# EAGLE design master_jorge3 (EAGLE 7.1.0)
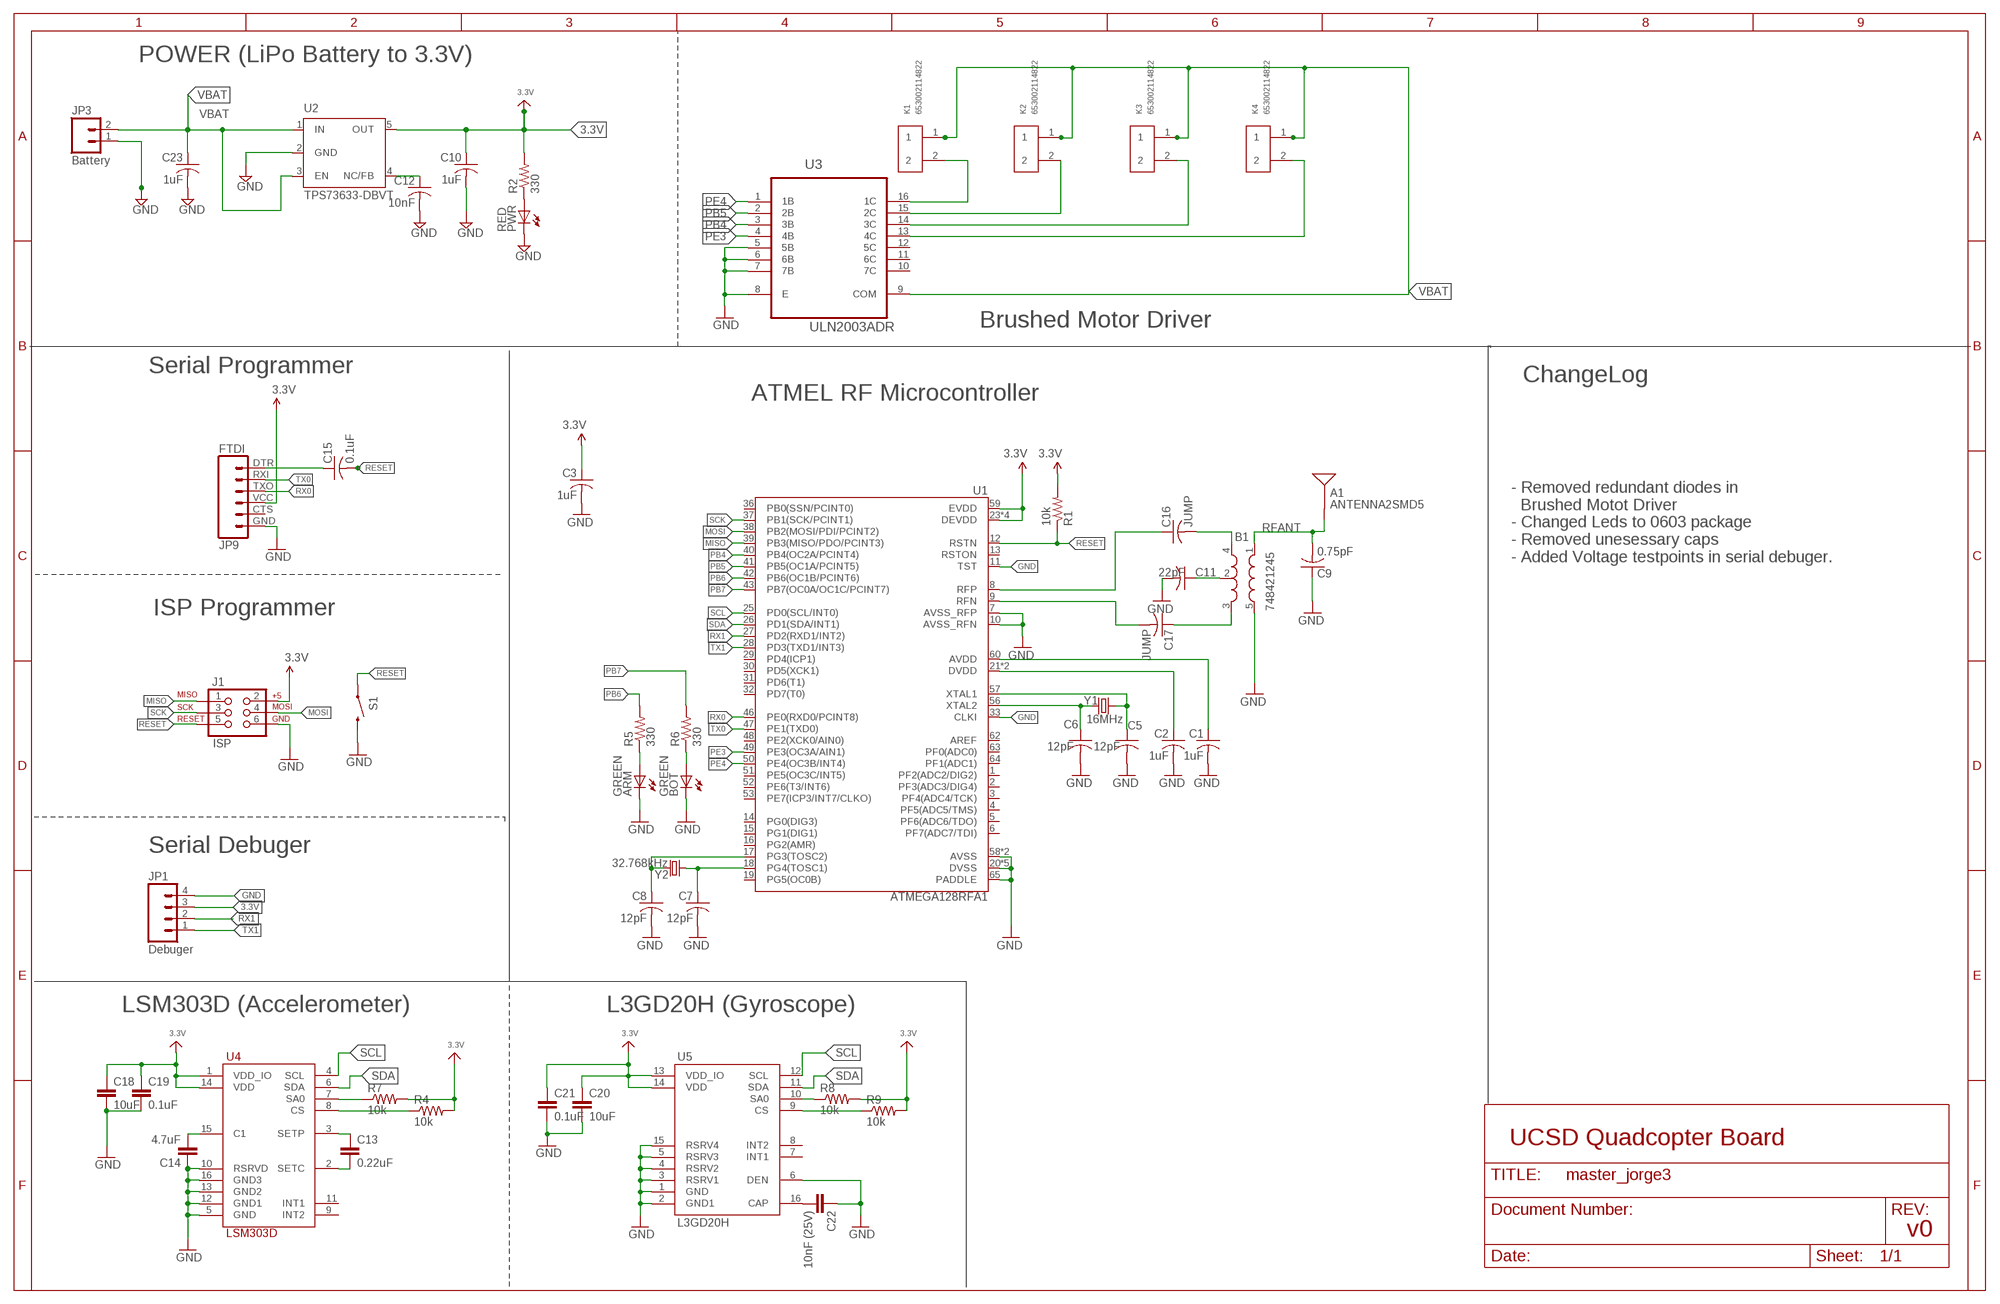
[diagram p0: schematic, sheet 1]

## Parts
A1  ANTENNA2SMD5  [ANTENNA-CHIP5]
ARM  GREEN  LEDCHIPLED_0603  [CHIPLED_0603]
B1  748421245  BALUN0805  [BALUN]
BOT  GREEN  LEDCHIPLED_0603  [CHIPLED_0603]
C1  1uF  C-USC0805  [C0805]
C2  1uF  C-USC0805  [C0805]
C3  1uF  C-USC0805  [C0805]
C5  12pF  C-USC0805  [C0805]
C6  12pF  C-USC0805  [C0805]
C7  12pF  C-USC0805  [C0805]
C8  12pF  C-USC0805  [C0805]
C9  0.75pF  C-USC0805  [C0805]
C10  1uF  C-USC0805  [C0805]
C11  22pF  C-USC0805  [C0805]
C12  10nF  C-USC0805  [C0805]
C13  0.22uF  CAP0805  [0805]
C14  4.7uF  CAP0805  [0805]
C15  0.1uF  C-USC0805  [C0805]
C16  JUMP  C-USC0805  [C0805]
C17  JUMP  C-USC0805  [C0805]
C18  10uF  CAP0805  [0805]
C19  0.1uF  CAP0805  [0805]
C20  10uF  CAP0805  [0805]
C21  0.1uF  CAP0805  [0805]
C22  10nF (25V)  CAP0805  [0805]
C23  1uF  C-USC0805  [C0805]
J1  ISP  AVR_SPI_PRG_6NS  [2X3-NS]
JP1  Debuger  M04PTH  [1X04]
JP3  Battery  M02PTH  [1X02]
JP9  FTDI  FTDI_BASICPTH  [FTDI_BASIC]
K1  653002114822  [653002114822]
K2  653002114822  [653002114822]
K3  653002114822  [653002114822]
K4  653002114822  [653002114822]
PWR  RED  LEDCHIPLED_0603  [CHIPLED_0603]
R1  10k  R-US_R0805  [R0805]
R2  330  R-US_R0805  [R0805]
R4  10k  RESISTOR0805-RES  [0805]
R5  330  R-US_R0805  [R0805]
R6  330  R-US_R0805  [R0805]
R7  10k  RESISTOR0805-RES  [0805]
R8  10k  RESISTOR0805-RES  [0805]
R9  10k  RESISTOR0805-RES  [0805]
S1  SWITCH-MOMENTARY-2SMD  [TACTILE_SWITCH_SMD]
U1  ATMEGA128RFA1  [QFN-64]
U2  TPS73633-DBVT  [SOT23-DBV]
U3  ULN2003ADR  [SOIC127P600X175-16N]
U4  LSM303D  [LGA16_3X3MM]
U5  L3GD20H  [LGA16_3X3MM]
Y1  16MHz  CRYSTAL5X3  [CRYSTAL-SMD-5X3]
Y2  32.768kHz  CRYSTAL32-SMD  [CRYSTAL-32KHZ-SMD]

## Nets
3.3V: C3.1 C10.1 C18.1 C19.1 C20.1 C21.1 J1.2 JP1.3 JP9.VCC R1.2 R2.2 R4.2 R7.2 R8.2 R9.2 U1.23(DEVDD) U1.34(DEVDD) U1.44(DEVDD) U1.54(DEVDD) U1.59(EVDD) U2.5(OUT) U4.1(VDD_IO) U4.14(VDD) U5.13(VDD_IO) U5.14(VDD)
AVDD: C1.1 U1.60(AVDD)
DTR: C15.1 JP9.DTR
DVDD: C2.1 U1.21(DVDD) U1.22(DVDD)
GND: ARM.C B1.5(GND) BOT.C C1.2 C2.2 C3.2 C5.2 C6.2 C7.2 C8.2 C9.1 C10.2 C11.2 C12.2 C14.1 C18.2 C19.2 C20.2 C21.2 C22.1 C23.2 J1.6 JP1.4 JP3.1 JP9.GND PWR.C S1.3 U1.7(AVSS_RFP) U1.10(AVSS_RFN) U1.11(TST) U1.20(DVSS) U1.24(DVSS) U1.33(CLKI) U1.35(DVSS) U1.45(DVSS) U1.55(DVSS) U1.58(AVSS) U1.61(AVSS) U1.65(PADDLE) U2.2(GND) U3.5(5B) U3.6(6B) U3.7(7B) U3.8(E) U4.5(GND) U4.10(RSRVD) U4.12(GND1) U4.13(GND2) U4.16(GND3) U5.1(GND) U5.2(GND1) U5.3(RSRV1) U5.4(RSRV2) U5.5(RSRV3) U5.6(DEN) U5.15(RSRV4)
MISO: J1.1 U1.39(PB3(MISO/PDO/PCINT3))
MOSI: J1.4 U1.38(PB2(MOSI/PDI/PCINT2))
N$1: C12.1 U2.4(NC/FB)
N$2: PWR.A R2.1
N$3: C5.1 U1.57(XTAL1) Y1.3
N$4: C6.1 U1.56(XTAL2) Y1.1
N$5: C7.1 U1.18(PG4(TOSC1)) Y2.X1
N$6: C8.1 U1.17(PG3(TOSC2)) Y2.X2
N$7: B1.2(GND) C11.1
N$8: ARM.A R5.1
N$9: C13.1 U4.3(SETP)
N$10: B1.4(OUT1) C16.2
N$11: B1.3(OUT2) C17.1
N$12: C13.2 U4.2(SETC)
N$13: BOT.A R6.1
N$14: R4.1 U4.8(CS)
N$15: R7.1 U4.7(SA0)
N$16: C14.2 U4.15(C1)
N$17: R8.1 U5.10(SA0)
N$18: R9.1 U5.9(CS)
N$19: C22.2 U5.16(CAP)
N$29: K1.2 U3.16(1C)
N$30: K2.2 U3.15(2C)
N$31: K3.2 U3.14(3C)
N$32: K4.2 U3.13(4C)
PB4: U1.40(PB4(OC2A/PCINT4)) U3.3(3B)
PB5: U1.41(PB5(OC1A/PCINT5)) U3.2(2B)
PB6: R5.2 U1.42(PB6(OC1B/PCINT6))
PB7: R6.2 U1.43(PB7(OC0A/OC1C/PCINT7))
PE3: U1.49(PE3(OC3A/AIN1)) U3.4(4B)
PE4: U1.50(PE4(OC3B/INT4)) U3.1(1B)
RESET: C15.2 J1.5 R1.1 S1.1 U1.12(RSTN)
RFANT [RFSIG]: A1.FEED(SIGNAL) B1.1(IN) C9.2
RFN: C17.2 U1.9(RFN)
RFP: C16.1 U1.8(RFP)
RX0: JP9.TXO U1.46(PE0(RXD0/PCINT8))
RX1: JP1.2 U1.27(PD2(RXD1/INT2))
SCK: J1.3 U1.37(PB1(SCK/PCINT1))
SCL: U1.25(PD0(SCL/INT0)) U4.4(SCL) U5.12(SCL)
SDA: U1.26(PD1(SDA/INT1)) U4.6(SDA) U5.11(SDA)
TX0: JP9.RXI U1.47(PE1(TXD0))
TX1: JP1.1 U1.28(PD3(TXD1/INT3))
VBAT: C23.1 JP3.2 K1.1 K2.1 K3.1 K4.1 U2.1(IN) U2.3(EN) U3.9(COM)
Unconnected: JP9.CTS U1.1(PF2(ADC2/DIG2)) U1.2(PF3(ADC3/DIG4)) U1.3(PF4(ADC4/TCK)) U1.4(PF5(ADC5/TMS)) U1.5(PF6(ADC6/TDO)) U1.6(PF7(ADC7/TDI)) U1.13(RSTON) U1.14(PG0(DIG3)) U1.15(PG1(DIG1)) U1.16(PG2(AMR)) U1.19(PG5(OC0B)) U1.29(PD4(ICP1)) U1.30(PD5(XCK1)) U1.31(PD6(T1)) U1.32(PD7(T0)) U1.36(PB0(SSN/PCINT0)) U1.48(PE2(XCK0/AIN0)) U1.51(PE5(OC3C/INT5)) U1.52(PE6(T3/INT6)) U1.53(PE7(ICP3/INT7/CLKO)) U1.62(AREF) U1.63(PF0(ADC0)) U1.64(PF1(ADC1)) U3.10(7C) U3.11(6C) U3.12(5C) U4.9(INT2) U4.11(INT1) U5.7(INT1) U5.8(INT2)

## Notes on the sheet
- POWER (LiPo Battery to 3.3V)
- Brushed Motor Driver
- Serial Programmer
- ChangeLog
- ATMEL RF Microcontroller
- - Removed redundant diodes in 
    Brushed Motot Driver
  - Changed Leds to 0603 package
  - Removed unesessary caps
  - Added Voltage testpoints in serial debuger.
- ISP Programmer
- Serial Debuger
- LSM303D (Accelerometer) | L3GD20H (Gyroscope)
- UCSD Quadcopter Board
- v0

## Library data of the parts
A1 = SparkFun-RF:ANTENNA2: Chip antenna Single endded antenna. Common with smaller chip antennas. CHIP4 package is the GPS Chip Antenna SKU: GPS-08418. CHIP5 package is 2.4GHz chip antenna SKU: WRL-00144.
ARM BOT PWR = led:LED: LED OSRAM: - CHIPLED LG R971, LG N971, LY N971, LG Q971, LY Q971, LO R971, LY R971 LH N974, LH R974 LS Q976, LO Q976, LY Q976 LO Q996 - Hyper CHIPLED LW Q18S LB Q993, LB Q99A, LB R99A - SideLED LS A670, LO A670, LY A670, LG A670, LP A670 LB A673, LV A673, LT A673, LW A673 LH A674 LY A675 LS A676, LA A676, LO A676, LY A676, LW A676 LS A679, LY A679, LG A679 - Hyper Micro SIDELED® LS Y876, LA Y876, LO Y876, LY Y876 LT Y87S - SmartLED LW L88C, LW L88S LB L89C, LB L89S, LG L890 LS L89K, LO L89K, LY L89K LS L896, LA L896, LO L896, LY L896 - TOPLED LS T670, LO T670, LY T670, LG T670, LP T670 LSG T670, LSP T670, LSY T670, LOP T670, LYG T670 LG T671, LOG T671, LSG T671 LB T673, LV T673, LT T673, LW T673 LH T674 LS T676, LA T676, LO T676, LY T676, LB T676, LH T676, LSB T676, LW T676 LB T67C, LV T67C, LT T67C, LS T67K, LO T67K, LY T67K, LW E67C LS E67B, LA E67B, LO E67B, LY E67B, LB E67C, LV E67C, LT E67C LW T67C LS T679, LY T679, LG T679 LS T770, LO T770, LY T770, LG T770, LP T770 LB T773, LV T773, LT T773, LW T773 LH T774 LS E675, LA E675, LY E675, LS T675 LS T776, LA T776, LO T776, LY T776, LB T776 LHGB T686 LT T68C, LB T68C - Hyper Mini TOPLED® LB M676 - Mini TOPLED Santana® LG M470 LS M47K, LO M47K, LY M47K Source: http://www.osram.convergy.de LUXEON: - LUMILED® LXK2-PW12-R00, LXK2-PW12-S00, LXK2-PW14-U00, LXK2-PW14-V00 LXK2-PM12-R00, LXK2-PM12-S00, LXK2-PM14-U00 LXK2-PE12-Q00, LXK2-PE12-R00, LXK2-PE12-S00, LXK2-PE14-T00, LXK2-PE14-U00 LXK2-PB12-K00, LXK2-PB12-L00, LXK2-PB12-M00, LXK2-PB14-N00, LXK2-PB14-P00, LXK2-PB14-Q00 LXK2-PR12-L00, LXK2-PR12-M00, LXK2-PR14-Q00, LXK2-PR14-R00 LXK2-PD12-Q00, LXK2-PD12-R00, LXK2-PD12-S00 LXK2-PH12-R00, LXK2-PH12-S00 LXK2-PL12-P00, LXK2-PL12-Q00, LXK2-PL12-R00 Source: www.luxeon.com KINGBRIGHT: KA-3528ASYC Source: www.kingbright.com
B1 = SparkFun-RF:BALUN: 0805 footprint balun- Ember 351/357
C1-C3 C5-C12 C15-C17 C23 = resistor:C-US: CAPACITOR, American symbol
C13 C14 C18-C22 = SparkFun-Capacitors:CAP: Capacitor Standard 0603 ceramic capacitor, and 0.1" leaded capacitor.
J1 = SparkFun-Connectors:AVR_SPI_PRG_6: AVR ISP 6 Pin This is the reduced ISP connector for AVR programming. Common on Arduino. This footprint will take up less PCB space and can be used with a 10-pin to 6-pin adapter such as SKU: BOB-08508
JP1 = SparkFun-Connectors:M04: Header 4 Standard 4-pin 0.1" header. Use with straight break away headers (SKU : PRT-00116), right angle break away headers (PRT-00553), swiss pins (PRT-00743), machine pins (PRT-00117), and female headers (PRT-00115). Molex polarized connector foot print use with SKU : PRT-08231 with associated crimp pins and housings. 1MM SMD Version SKU: PRT-10208
JP3 = SparkFun:M02: Header 2 Standard 2-pin 0.1" header. Use with straight break away headers (SKU : PRT-00116), right angle break away headers (PRT-00553), swiss pins (PRT-00743), machine pins (PRT-00117), and female headers (PRT-00115). Molex polarized connector foot print use with SKU : PRT-08233 with associated crimp pins and housings.
JP9 = SparkFun-Connectors:FTDI_BASIC: FTDI Basic header with labels
K1-K4 = Wuerth_Elektronik_eiCan_Wire_to_Board_Connectors:653002114822: WR-WTB 1.25mm Male Vertical Shrouded Header, 2 Pins=>Code : Con_WTB_1.25_PCB_THT_653002114822 <http://katalog.we-online.de/media/thumbs2/eican/thb_Con_WTB_1.25_PCB_THT_6530xx114822_pf2.jpg> Details see: http://katalog.we-online.de/en/em/653_0xx_114_822 Created 2014-06-06, Karrer Zheng 2014 (C) Würth Elektronik; OC_FARNELL: unknown
R1 R2 R5 R6 = resistor:R-US_: RESISTOR, American symbol
R4 R7-R9 = SparkFun-Passives:RESISTOR: Resistor Basic schematic elements and footprints for 0603, 1206, and PTH resistors.
S1 = SparkFun-Electromechanical:SWITCH-MOMENTARY-2: Various NO switches- pushbuttons, reed, etc
U1 = SparkFun-DigitalIC:ATMEGA128RFA1: ATmega128RFA1 8-bit AVR Microcontroller with Low Power 2.4GHz Transceiver for ZigBee and IEEE 802.15.4
U2 = Power:TPS73633-DBVT
U3 = Texas Instruments_By_element14_Batch_1:ULN2003ADR: 8-BIT SHIFT REGISTERS WITH 3-STATE OUTPUT REGISTERS; MPN: ULN2003ADR; OC_FARNELL: 1470513; OC_NEWARK: 77C3560; PACKAGE: SOIC-16; SUPPLIER: TEXAS INSTRUMENTS
U4 = IMU_parts:LSM303D
U5 = IMU_parts:L3GD20H
Y1 Y2 = SparkFun-FreqCtrl:CRYSTAL: Various standard crystals. Proven footprints. Spark Fun Electronics SKU : COM-00534

## Net classes
1 RFSIG: width 0.457 mm, clearance 0.205 mm to class 0, clearance 0.205 mm

## Board
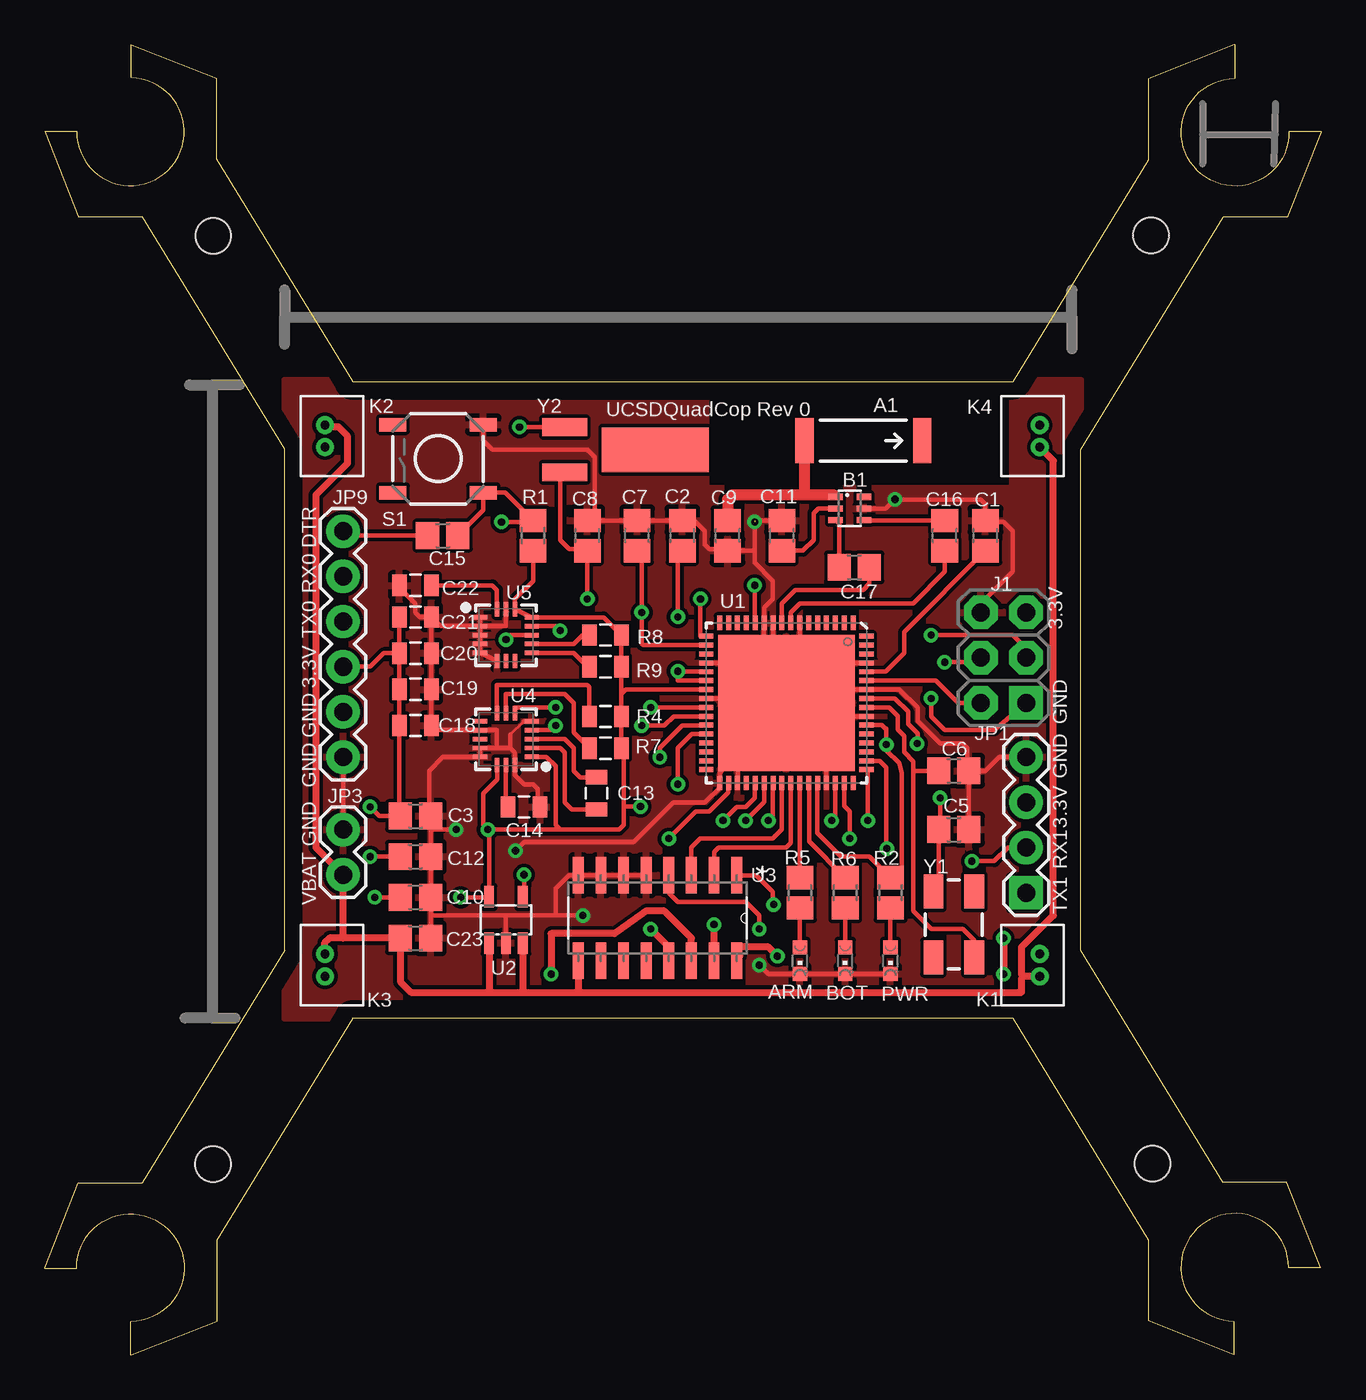
[diagram p1: board, top side]
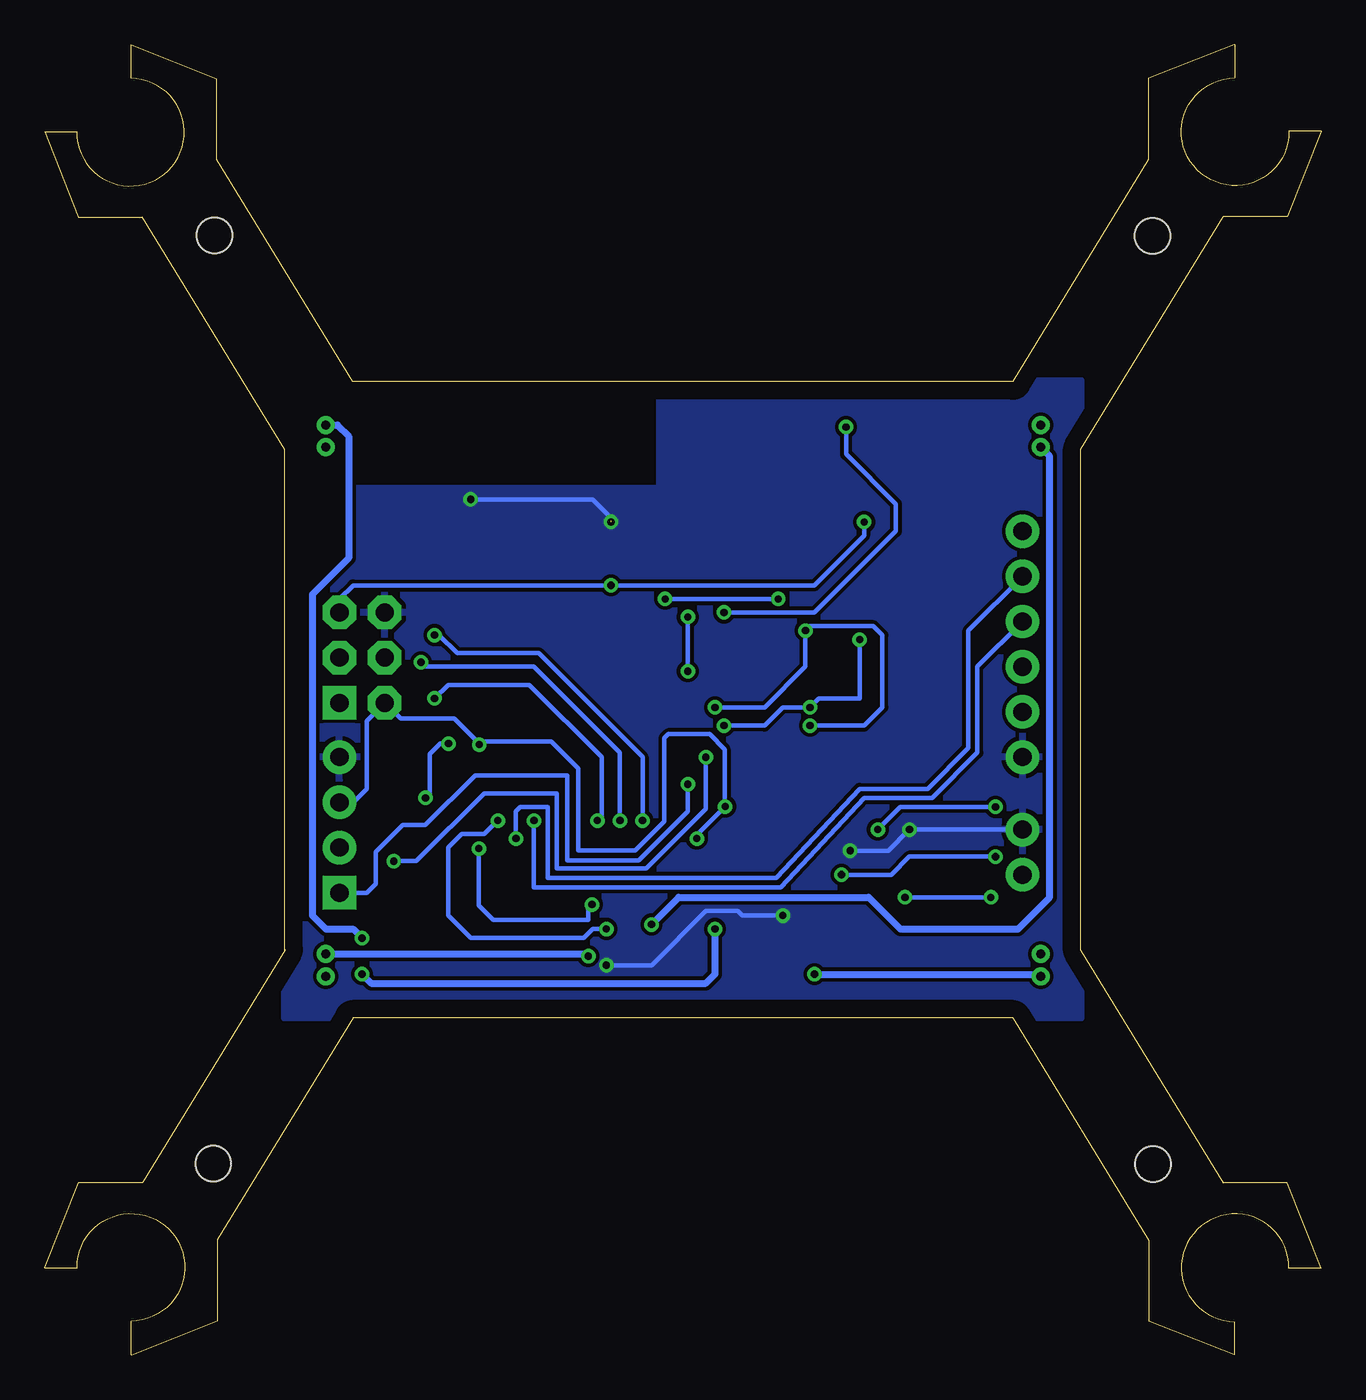
[diagram p2: board, bottom side, seen from below]

Size 71.68 x 73.61 mm. Coordinates in mm from the lower left corner, seen from the top.
Outline: 54.38,18.92 17.3,18.92 17.3,18.9 9.68,6.45 9.68,1.9 4.88,0 4.85,0 4.85,1.88 arc270 1.8,4.9 1.8,4.88 0,4.88 1.91,9.68 5.49,9.68 13.49,22.73 13.49,50.88 5.49,63.93 1.91,63.93 0,68.73 1.8,68.73 1.8,68.71 arc270 4.85,71.73 4.85,73.61 4.88,73.61 9.68,71.7 9.68,67.16 17.3,54.71 17.3,54.66
Outline: 58.19,22.73 58.19,50.85 66.19,63.91 69.77,63.91 71.68,68.71 69.88,68.71 69.88,68.68 arc-270 66.83,71.7 66.83,73.58 66.8,73.58 62,71.68 62,67.13 54.38,54.69
Outline: 17.3,54.68 54.38,54.68
Outline: 54.36,18.92 61.98,6.48 61.98,1.93 66.78,0.02 66.8,0.02 66.8,1.9 arc-270 69.85,4.93 69.85,4.9 71.65,4.9 69.75,9.7 66.17,9.7 58.17,22.76
Copper layers (1*16): Top 0.035mm / dielectric 1.5mm / Bottom 0.035mm
Design rules "default *": minimum track width 1mil, minimum drill 0.003mm, track to track 8mil, track to pad 8mil, pad to pad 8mil, via to via 8mil, smd to smd 8mil, copper to edge 40mil, drill to drill 8mil, minimum pad ring 10mil, minimum via ring 8mil, stop-mask expansion 4mil, vias tented up to drill 0mil, thermal gap 10mil
Holes 2.2 mm at -42.93,48.46
Holes 2 mm at 9.45,10.72 62.2,10.74 9.47,62.86 62.13,62.89
tRestrict: area 41.7,52.9 to 48.4,52.9; area 37.4,48.9 to 41.9,54.5; area 43.5,48.9 to 48.5,54.5; area 49.8,48.9 to 54.1,54.5; area 41.9,53 to 43.5,54.5; area 48.5,53 to 49.8,54.5; area 48.5,48.9 to 49.8,49.9
bRestrict: area 41.9,48.9 to 43.5,53; area 37.4,48.9 to 41.9,54.5; area 41.9,53 to 43.5,54.5; area 43.5,48.9 to 48.5,54.5; area 48.5,53 to 49.8,54.5; area 49.8,48.9 to 54.1,54.5; area 48.5,48.9 to 49.8,49.9

### Footprints (pad centres in the part's own frame; a part is rotated, then mirrored left to right if it is on the bottom)
ANTENNA-CHIP5 = smd 1.016 x 2.54: FEED -3.302,0; NC 3.302,0
CHIPLED_0603 = smd 0.8 x 0.8: A 0,-0.75; C 0,0.75
BALUN = smd 0.35 x 0.8: 1 -0.65,-0.8; 2 0,-0.8; 3 0.65,-0.8; 4 0.65,0.8; 5 0,0.8; 6 -0.65,0.8
C0805 = smd 1.3 x 1.5: 1 -0.85,0; 2 0.85,0
0805 = smd 0.8 x 1.2: 1 -0.9,0; 2 0.9,0
2X3-NS = drill 1.016 pad 1.88 square: 1 -2.54,-1.27 | drill 1.016 pad 1.88 octagon: 2 -2.54,1.27; 3 0,-1.27; 4 0,1.27; 5 2.54,-1.27; 6 2.54,1.27
1X04 = drill 1.016 pad 1.88 square: 1 0,0 | drill 1.016 pad 1.88: 2 2.54,0; 3 5.08,0; 4 7.62,0
1X02 = drill 1.016 pad 1.88: 1 0,0; 2 2.54,0
FTDI_BASIC = drill 1.016 pad 1.88: CTS 10.16,0; DTR 0,0; GND 12.7,0; RXI 2.54,0; TXO 5.08,0; VCC 7.62,0
653002114822 = drill 0.5: 1 0.625,0; 2 -0.625,0
R0805 = smd 1.3 x 1.5: 1 -0.85,0; 2 0.85,0
TACTILE_SWITCH_SMD = smd 1.524 x 0.762: 1 -2.54,1.905; 2 2.54,1.905; 3 -2.54,-1.905; 4 2.54,-1.905
QFN-64 = smd 0.8 x 0.28: 1 -4.5,3.75; 2 -4.5,3.25; 3 -4.5,2.75; 4 -4.5,2.25; 5 -4.5,1.75; 6 -4.5,1.25; 7 -4.5,0.75; 8 -4.5,0.25; 9 -4.5,-0.25; 10 -4.5,-0.75; 11 -4.5,-1.25; 12 -4.5,-1.75; 13 -4.5,-2.25; 14 -4.5,-2.75; 15 -4.5,-3.25; 16 -4.5,-3.75; 33 4.5,-3.75; 34 4.5,-3.25; 35 4.5,-2.75; 36 4.5,-2.25; 37 4.5,-1.75; 38 4.5,-1.25; 39 4.5,-0.75; 40 4.5,-0.25; 41 4.5,0.25; 42 4.5,0.75; 43 4.5,1.25; 44 4.5,1.75; 45 4.5,2.25; 46 4.5,2.75; 47 4.5,3.25; 48 4.5,3.75 | smd 0.28 x 0.8: 17 -3.75,-4.5; 18 -3.25,-4.5; 19 -2.75,-4.5; 20 -2.25,-4.5; 21 -1.75,-4.5; 22 -1.25,-4.5; 23 -0.75,-4.5; 24 -0.25,-4.5; 25 0.25,-4.5; 26 0.75,-4.5; 27 1.25,-4.5; 28 1.75,-4.5; 29 2.25,-4.5; 30 2.75,-4.5; 31 3.25,-4.5; 32 3.75,-4.5; 49 3.75,4.5; 50 3.25,4.5; 51 2.75,4.5; 52 2.25,4.5; 53 1.75,4.5; 54 1.25,4.5; 55 0.75,4.5; 56 0.25,4.5; 57 -0.25,4.5; 58 -0.75,4.5; 59 -1.25,4.5; 60 -1.75,4.5; 61 -2.25,4.5; 62 -2.75,4.5; 63 -3.25,4.5; 64 -3.75,4.5 | smd 7.65 x 7.65: 65 0,0
SOT23-DBV = smd 0.55 x 1.2: 1 -0.95,-1.3; 2 0,-1.3; 3 0.95,-1.3; 4 0.95,1.3; 5 -0.95,1.3
SOIC127P600X175-16N = smd 2.057 x 0.61: 1 -4.801,8.89; 2 -4.801,7.62; 3 -4.801,6.35; 4 -4.801,5.08; 5 -4.801,3.81; 6 -4.801,2.54; 7 -4.801,1.27; 8 -4.801,0; 9 0,0; 10 0,1.27; 11 0,2.54; 12 0,3.81; 13 0,5.08; 14 0,6.35; 15 0,7.62; 16 0,8.89
LGA16_3X3MM = smd 0.8 x 0.25: 1 -1.45,1; 2 -1.45,0.5; 3 -1.45,0; 4 -1.45,-0.5; 5 -1.45,-1; 9 1.45,-1; 10 1.45,-0.5; 11 1.45,0; 12 1.45,0.5; 13 1.45,1 | smd 0.25 x 0.8: 6 -0.5,-1.45; 7 0,-1.45; 8 0.5,-1.45; 14 0.5,1.45; 15 0,1.45; 16 -0.5,1.45
CRYSTAL-SMD-5X3 = smd 1.9 x 1.1: 1 -1.85,-1.15; 2 1.85,-1.15; 3 1.85,1.15; 4 -1.85,1.15
CRYSTAL-32KHZ-SMD = smd 2.5 x 6: SHEILD 0,5.08 | smd 1 x 2.5: X1 -1.27,0; X2 1.27,0

### Placement (x,y rotation side)
A1  45.97,51.36 0 top
ARM  42.42,22.15 180 top
B1  45.21,47.55 270 top
BOT  44.96,22.15 180 top
C1  52.83,46.02 90 top
C2  35.81,46.02 90 top
C3  20.83,30.28 0 top
C5  51.05,29.51 0 top
C6  51.05,32.82 0 top
C7  33.27,46.02 90 top
C8  30.48,46.02 90 top
C9  38.35,46.02 90 top
C10  20.83,25.7 0 top
C11  41.4,46.02 90 top
C12  20.83,27.99 0 top
C13  30.99,31.55 270 top
C14  26.92,30.78 180 top
C15  22.35,46.02 0 top
C16  50.55,46.02 90 top
C17  45.47,44.25 0 top
C18  20.83,35.36 0 top
C19  20.83,37.39 0 top
C20  20.83,39.42 0 top
C21  20.83,41.45 0 top
C22  20.83,43.23 0 top
C23  20.83,23.42 0 top
J1  53.85,39.17 90 top
JP1  55.12,25.96 90 top
JP3  16.76,29.51 270 top
JP9  16.76,46.28 270 top
K1  55.88,21.89 270 top
K2  15.75,51.61 90 top
K3  15.75,21.89 90 top
K4  55.88,51.61 270 top
PWR  47.5,22.15 180 top
R1  27.43,46.02 270 top
R2  47.5,25.96 90 top
R4  31.5,35.86 0 top
R5  42.42,25.96 90 top
R6  44.96,25.96 90 top
R7  31.5,34.09 0 top
R8  31.5,40.44 0 top
R9  31.5,38.66 0 top
S1  22.1,50.34 180 top
U1  41.66,36.63 270 top
U2  25.91,24.43 0 top
U3  29.97,22.15 270 top
U4  25.91,34.59 180 top
U5  25.91,40.44 0 top
Y1  51.05,24.18 90 top
Y2  29.21,50.85 270 top

### Tracks (layer width: path | path; a pad name or v marks a point on that pad's centre or on a via)
3.3V  (via drill 0.41)
  Top 0.254: 32.4,37.13 R9.2 R8.2 31.4,41.44 U5.13 U5.14 26.41,42.46 27.43,43.48 R1.2 | 32.4,37.13 R4.2 R7.2 32.51,33.97 32.51,30.82 | J1.2 51.31,36.63 50.04,37.9 46.18,37.9 U1.59 | 32.51,30.82 32.51,29.77 32.26,29.52 28.96,29.52 | U1.23 32.64,37.38 32.4,37.13 | C21.1 C20.1 | C20.1 C19.1 C18.1 19.93,30.33 C3.1 18.8,30.28 v18.29,30.78 | U4.14 25.41,32.32 24.64,31.55 24.64,29.77 v24.89,29.52 | v24.89,29.52 28.96,29.52 | U4.1 28.18,33.59 28.7,33.07 28.7,29.77 28.96,29.52 | C20.1 19.05,39.42 18.29,38.66 JP9.VCC | v24.89,29.52 24.96,29.45 U2.5 24.93,25.7 v23.37,25.7 | C10.1 v18.54,25.7 | U1.54 47.02,35.38 47.22,35.18 47.27,35.18 v47.27,34.29 47.27,33.96 47.98,33.25 48.13,32.69 48.13,27.32 R2.2 46.32,27.99 44.7,27.99 43.38,29.31 43.38,32.11 | U1.34 38.4,31.6 37.34,30.53 36.58,30.53 v35.05,29.01 | 43.38,32.13 U1.44 43.38,32.11 | 43.38,32.23 43.38,32.11 | v33.46,30.81 32.53,30.81 32.51,30.82
  Bottom 0.254: v18.29,30.78 23.62,30.78 v24.89,29.52 | v18.54,25.7 v23.37,25.7 | JP1.3 54.36,31.04 53.59,31.8 53.59,35.61 J1.2 51.69,35.74 48.67,35.74 47.27,34.34 v47.27,34.29 47.09,34.47 43.23,34.47 41.71,32.94 41.71,28.35 38.51,28.35 36.88,29.97 36.88,34.65 36.65,34.87 34.34,34.87 33.49,34.02 33.49,30.84 v33.46,30.81 35.05,29.21 v35.05,29.01
AVDD
  Top 0.254: U1.60 46.18,38.41 47.24,38.41 48.26,39.42 48.26,40.6 C1.1
DTR
  Top 0.254: C15.1 17.02,46.02 JP9.DTR
DVDD  (via drill 0.41)
  Top 0.254: C2.1 35.56,45.17 v35.56,41.45 | U1.22 37.16,37.9 35.56,37.9 v35.56,38.41 37.16,38.41 U1.21
  Bottom 0.254: v35.56,41.45 v35.56,38.41
GND  (via drill 0.41)  (1 unrouted)
  Top 0.178: 26.16,34.85 26.92,35.61
  Top 0.241: 26.92,35.61 27.34,35.61 U4.5
  Top 0.254: C23.2 21.68,24.69 | 21.68,24.69 C10.2 C12.2 21.68,29.52 | 21.68,29.52 C3.2 21.59,30.36 21.59,32.82 22.37,33.59 U4.13 U4.12 | 25.91,24.69 21.68,24.69 | C6.2 C5.2 | U3.5 U3.6 U3.7 U3.8 29.44,26.95 28.7,26.21 28.7,24.69 | 31.01,46.88 C7.2 C2.2 36.49,46.88 37.08,46.28 37.08,45.52 37.34,45.26 38.27,45.26 C9.1 39.88,45.17 | 31.01,46.88 C8.2 | 24.64,52.38 S1.3 24.64,51.36 25.15,50.85 30.48,50.85 30.89,50.44 30.89,47 31.01,46.88 | U5.2 24.45,40.94 22.24,40.94 C21.2 | 26.16,34.09 26.41,33.84 U4.16 26.41,32.57 26.92,32.05 27.43,32.05 27.69,31.8 27.69,30.92 C14.1 | 26.16,34.09 25.4,34.09 | 25.4,34.09 U4.12 | U4.12 | U4.5 26.91,35.59 | 26.16,34.85 26.16,34.09 | U5.1 U5.2 | U5.2 U5.3 U5.4 U5.5 U5.6 | 25.4,34.09 25.4,35.1 25.39,35.09 U4.10 21.99,35.09 C18.2 C19.2 C20.2 C21.2 | JP9.GND JP3.1 | U5.15 25.91,40.94 24.46,40.94 U5.2 | C22.1 19.93,43.11 20.83,42.22 20.83,41.71 21.08,41.45 C21.2 | v23.11,29.52 21.68,29.52 | JP1.4 53.59,33.58 52.83,32.82 C6.2 | U1.10 40.91,37.38 | 40.91,37.38 U1.65 | 40.91,37.38 40.41,36.88 39.07,36.88 | U1.7 42.41,38.88 | 42.41,38.88 40.91,37.38 | 42.41,38.88 U1.61 | U1.10 40.91,39.69 40.39,39.17 40.39,41.11 U1.11 40.41,41.98 40.89,42.47 40.89,43.48 39.88,44.5 39.88,45.17 | U1.10 40.91,39.16 41.4,38.66 39.12,38.66 38.86,38.91 38.83,38.88 U1.20 | U1.10 40.91,40.17 43.69,37.39 | 43.69,37.39 46.16,37.39 | U1.10 40.91,36.64 | 39.88,45.17 39.88,46.88 C11.2 | B1.5 47.24,47.55 v47.75,48.06 52.58,48.06 52.83,47.8 C1.2 52.92,46.79 53.85,46.79 54.36,46.28 54.36,43.99 52.58,42.22 J1.6 | 46.17,37.39 U1.58 46.16,37.39 | 47.5,21.39 PWR.C BOT.C ARM.C 40.63,21.4 v40.13,21.89 | v30.23,24.69 28.7,24.69
  Top 0.254: C6.2 51.82,32.91 51.82,34.09 51.56,34.34 50.29,34.34 49.02,35.61 49.02,36.37 48.01,37.39 46.16,37.39 | U2.2 25.91,24.69 | 25.91,24.69 28.7,24.69 | U1.24 39.07,36.88 | 38.91,33.86 37.91,32.7 U1.33 37.91,31.86 37.08,31.04 35.31,31.04 33.78,29.52 33.09,28.82 26.94,28.82 v26.44,28.32 | 38.91,33.86 39.12,34.09 39.12,36.83 39.07,36.88 | U1.45 43.91,35.88 | 43.91,35.88 43.91,37.17 43.69,37.39 | U1.55 43.91,35.88 | U1.35 38.91,33.86
  Bottom 0.254: JP3.1 v23.11,29.52 24.31,28.32 v26.44,28.32 | v39.88,46.79 39.88,47.04 40.89,48.06 v47.75,48.06 | v30.23,24.69 32.51,24.69 32.77,24.94 34.54,24.94 37.59,21.89 v40.13,21.89
  pour Top: 13.49,54.74 13.49,18.92 58.19,18.92 58.19,54.74
  pour Bottom: 13.49,54.74 13.49,18.92 58.19,18.92 58.19,54.74
MISO  (via drill 0.41)
  Top 0.254: v40.64,30.02 40.89,30.28 40.89,32.11 U1.39 | J1.1 53.34,35.1 50.55,35.1 49.78,35.86 v49.78,36.88
  Bottom 0.254: v40.64,30.02 40.39,30.28 40.39,33.58 44.45,37.64 49.02,37.64 v49.78,36.88
MOSI  (via drill 0.41)
  Top 0.254: U1.38 40.41,31.06 v39.37,30.02 | v50.55,38.91 52.32,38.91 J1.4
  Bottom 0.254: v39.37,30.02 39.37,33.83 44.2,38.66 50.29,38.66 v50.55,38.91
N$1  (via drill 0.41)
  Top 0.254: C12.1 v18.29,27.99 | v26.92,26.97 26.92,25.8 U2.4
  Bottom 0.254: v18.29,27.99 23.11,27.99 24.13,26.97 v26.92,26.97
N$2
  Top 0.254: R2.1 PWR.A
N$3  (via drill 0.41)
  Top 0.254: Y1.3 50.2,26.33 C5.1 50.29,29.6 v50.29,31.29 | U1.57 47.75,36.88 48.49,36.14 48.49,35.43 49.02,34.9 49.02,34.37 v49,34.34
  Bottom 0.254: v50.29,31.29 50.04,31.55 50.04,33.76 49.45,34.34 v49,34.34
N$4
  Top 0.254: Y1.1 52.2,23.28 51.56,23.93 49.78,23.93 48.77,24.94 48.77,32.82 | 48.77,32.82 48.77,33.35 48.26,33.86 48.26,34.77 47.9,35.13 47.9,35.89 47.42,36.37 U1.56 | C6.1 48.77,32.82
N$5  (via drill 0.41)
  Top 0.254: Y2.X1 29.46,52.12 | Y2.X1 28.45,52.12 | C7.1 33.53,44.92 v33.53,41.71 33.53,39.93 33.55,39.93 33.6,39.88 U1.18 | v26.67,52.12 Y2.X1
  Bottom 0.254: v33.53,41.71 28.45,41.71 23.88,46.28 23.88,47.8 26.67,50.6 v26.67,52.12
N$6  (via drill 0.41)
  Top 0.254: Y2.X2 28.96,49.58 28.96,45.77 29.46,45.26 30.39,45.26 C8.1 v30.48,42.47 | U1.17 36.83,40.38 v36.83,42.47
  Bottom 0.254: v36.83,42.47 v30.48,42.47
N$7
  Top 0.254: C11.1 42.58,45.17 43.18,45.77 43.18,47.3 43.43,47.55 B1.2
N$8
  Top 0.254: R5.1 ARM.A
N$9
  Top 0.254: C13.1 30.09,32.45 29.72,32.82 29.72,34.09 29.21,34.59 U4.3
N$10
  Top 0.254: C16.2 46.04,46.88 B1.4
N$11
  Top 0.254: C17.1 44.62,46.69 B1.3
N$12
  Top 0.254: C13.2 29.6,30.65 29.21,31.04 29.21,33.83 28.95,34.09 U4.2
N$13
  Top 0.254: R6.1 BOT.A
N$14
  Top 0.254: R4.1 30.6,37.53 30.48,37.64 25.4,37.64 U4.8
N$15
  Top 0.254: U4.7 25.91,37.13 29.21,37.13 29.72,36.63 29.72,34.97 R7.1
N$16
  Top 0.254: C14.2 26.02,31.18 25.91,31.29 U4.15
N$17
  Top 0.254: R8.1 30.23,40.44 29.72,39.93 U5.10
N$18
  Top 0.254: R9.1 30.48,38.66 29.72,39.42 27.37,39.42 U5.9
N$19
  Top 0.254: C22.2 25.15,43.23 25.4,42.98 25.4,41.89 U5.16
N$29  (via drill 0.41)
  Top 0.254: 39.12,22.4 U3.16
  Top 0.406: U3.16 38.86,22.91 40.64,22.91 v41.15,22.4
  Bottom 0.254: 41.01,22.52 v41.15,22.4
  Bottom 0.406: K1.2 41.01,22.52
N$30  (via drill 0.41)
  Top 0.406: U3.15 v37.59,24.18
  Bottom 0.406: v37.59,24.18 36.07,25.7 25.4,25.7 23.62,23.93 17.02,23.93 15.24,25.7 15.24,50.48 K2.2
N$31  (via drill 0.41)
  Top 0.406: U3.14 36.32,23.42 34.8,24.94 33.78,24.94 32,23.67 28.45,23.67 v28.45,21.39
  Bottom 0.406: v28.45,21.39 15.87,21.39 K3.2
N$32  (via drill 0.41)
  Top 0.254: U3.13 35.05,22.91
  Top 0.406: 35.05,22.91 v34.04,23.93 | v53.85,23.42 v53.85,21.39
  Bottom 0.406: v34.04,23.93 34.04,21.39 34.54,20.88 53.34,20.88 v53.85,21.39 | K4.2 55.24,52.24 54.61,51.61 54.61,44.75 56.64,42.72 56.64,24.69 55.88,23.93 54.36,23.93 v53.85,23.42
PB4
  Top 0.254: U3.3 36.32,28.5 36.83,29.01 40.89,29.01 41.4,29.52 U1.40
PB5
  Top 0.254: U3.2 37.59,28.24 37.85,28.5 41.66,28.5 41.91,28.75 U1.41
PB6
  Top 0.254: R5.2 42.42,32.11 U1.42
PB7
  Top 0.254: U1.43 42.93,32.11 42.93,28.84 R6.2
PE3  (via drill 0.41)
  Top 0.254: v46.23,30.02 46.23,32.8 U1.49 | U3.4 35.05,25.96 35.56,25.45 39.37,25.45 40.13,24.69 v40.13,23.93
  Bottom 0.254: v46.23,30.02 46.99,29.26 48.26,29.26 49.02,28.5 49.02,24.69 47.75,23.42 41.4,23.42 40.89,23.93 v40.13,23.93
PE4  (via drill 0.41)
  Top 0.254: U1.50 46.89,33.38 47.27,32.99 47.27,28.47 v47.29,28.45 | U3.1 39.96,26.95 40.89,26.02 40.89,25.36 v40.94,25.3
  Bottom 0.254: v47.29,28.45 47.29,25.25 46.48,24.43 41.15,24.43 41.15,25.1 v40.94,25.3
RESET  (via drill 0.41)
  Top 0.254: C15.2 24.64,47.46 S1.1 25.87,48.44 R1.1 27.34,46.79 v25.65,46.79 | v39.88,43.23 39.88,41.16 U1.12
  Bottom 0.254: J1.5 55.12,42.47 54.36,43.23 v39.88,43.23 28.45,43.23 25.65,46.02 v25.65,46.79
RFANT
  Top 0.254: 44.3,48.31 44.41,48.31 B1.1
  Top 0.61: 42.67,48.31 38.61,48.31 38.35,48.06 C9.2 | A1.FEED 42.67,48.31 | 44.3,48.31 42.67,48.31
RFN
  Top 0.254: C17.2 46.32,43.32 45.97,42.98 42.16,42.98 41.4,42.22 U1.9
RFP
  Top 0.254: U1.8 41.91,41.7 42.42,42.22 48.77,42.22 50.55,43.99 C16.1
RX0  (via drill 0.41)
  Top 0.254: U1.46 44.41,30.23 v44.2,30.02
  Bottom 0.254: JP9.TXO 19.3,38.66 19.3,33.83 21.84,31.29 25.65,31.29 30.35,26.26 44.2,26.26 v44.2,30.02
RX1  (via drill 0.41)
  Top 0.254: v52.07,27.74 53.34,27.74 54.1,28.5 JP1.2 | U1.27 37.14,35.36 35.81,35.36 34.54,34.09 v34.54,33.58
  Bottom 0.254: v52.07,27.74 50.8,27.74 46.99,31.55 42.93,31.55 42.93,27.33 37.9,27.33 34.54,30.68 v34.54,33.58
SCK  (via drill 0.41)
  Top 0.254: J1.3 55.12,39.67 54.36,40.44 v49.78,40.44 | v38.1,30.02 38.86,30.78 39.37,30.78 39.88,31.29 39.88,32.1 U1.37
  Bottom 0.254: v49.78,40.44 49.53,40.44 48.51,39.42 43.94,39.42 38.1,33.58 v38.1,30.02
SCL  (via drill 0.41)
  Top 0.254: U5.12 28.71,40.94 v28.96,40.69 | v34.04,36.37 U1.25 | U4.4 28.44,35.09 v28.7,35.36
  Bottom 0.254: v34.04,36.37 31.24,36.37 28.96,38.66 v28.96,40.69 28.7,40.94 25.15,40.94 24.64,40.44 24.64,36.37 25.65,35.36 v28.7,35.36
SDA  (via drill 0.41)
  Top 0.254: v28.7,36.37 26.41,36.37 U4.6 | U1.26 35.32,35.88 34.8,35.36 v33.53,35.36 | U5.11 26.16,40.44 v25.91,40.18
  Bottom 0.254: v25.91,40.18 25.91,36.88 28.19,36.88 v28.7,36.37 30.23,36.37 31.24,35.36 v33.53,35.36
TX0  (via drill 0.41)
  Top 0.254: U1.47 44.91,30.84 45.21,30.53 v45.21,29.01
  Bottom 0.254: v45.21,29.01 45.21,30.53 44.96,30.78 43.43,30.78 43.43,26.8 30.58,26.8 25.91,31.8 22.1,31.8 19.81,34.09 19.81,40.69 JP9.RXI
TX1  (via drill 0.41)
  Top 0.254: v35.56,32.05 35.56,34.09 36.35,34.88 U1.28
  Bottom 0.254: JP1.1 53.59,25.96 53.09,26.47 53.09,28.24 51.56,29.77 50.29,29.77 47.5,32.56 42.34,32.56 42.34,27.79 38.3,27.79 35.56,30.53 v35.56,32.05
VBAT
  Top 0.254: 29.97,21.13 U3.9 | 26.86,20.44 26.92,20.37 | 24.96,20.44 24.89,20.37 | K1.1 56.27,21.27 | 54.86,21.39 54.98,21.27 54.86,21.15
  Top 0.406: 16.76,23.42 JP3.2 15.24,28.5 15.24,48.31 17.02,50.09 17.02,51.61 16.51,52.12 15.87,52.12 K2.1 | 16.76,23.42 C23.1 19.98,20.97 20.57,20.37 24.89,20.37 26.92,20.37 29.97,20.37 | K3.1 15.75,23.16 16,23.42 16.76,23.42 | U3.9 29.97,20.37 | U2.3 26.86,20.44 | U2.1 24.96,20.44 | K1.1 54.98,21.27 | 54.86,21.39 54.86,22.91 56.64,24.69 56.64,50.23 K4.1 | 29.97,20.37 54.86,20.37 54.86,21.15

### Text on the board
tPlace: UCSDQuadCop Rev 0 | DTR | RX0 | 3.3V | TX0 | 3.3V | GND | GND | GND | GND | 3.3V | GND | RX1 | VBAT | TX1
tDocu: 0.238 inch / 6.045 mm | 2.90 inch / 73.66 mm | 1.4 inch / 35.56 mm | 1.41 inch / 35.81 mm | >Info / Board Name: UCSDQuadCop / Part Number: 0 / Number of Layers: 2 / Board Material Type: FR-4 / Solder Mask Color: Red / Silkscreen Color: White / Finish Plating: HASAL / Revision Number: 0 | 2.82 inch / 71.70 mm